# EAGLE design PWB-MXR (EAGLE 6.1)
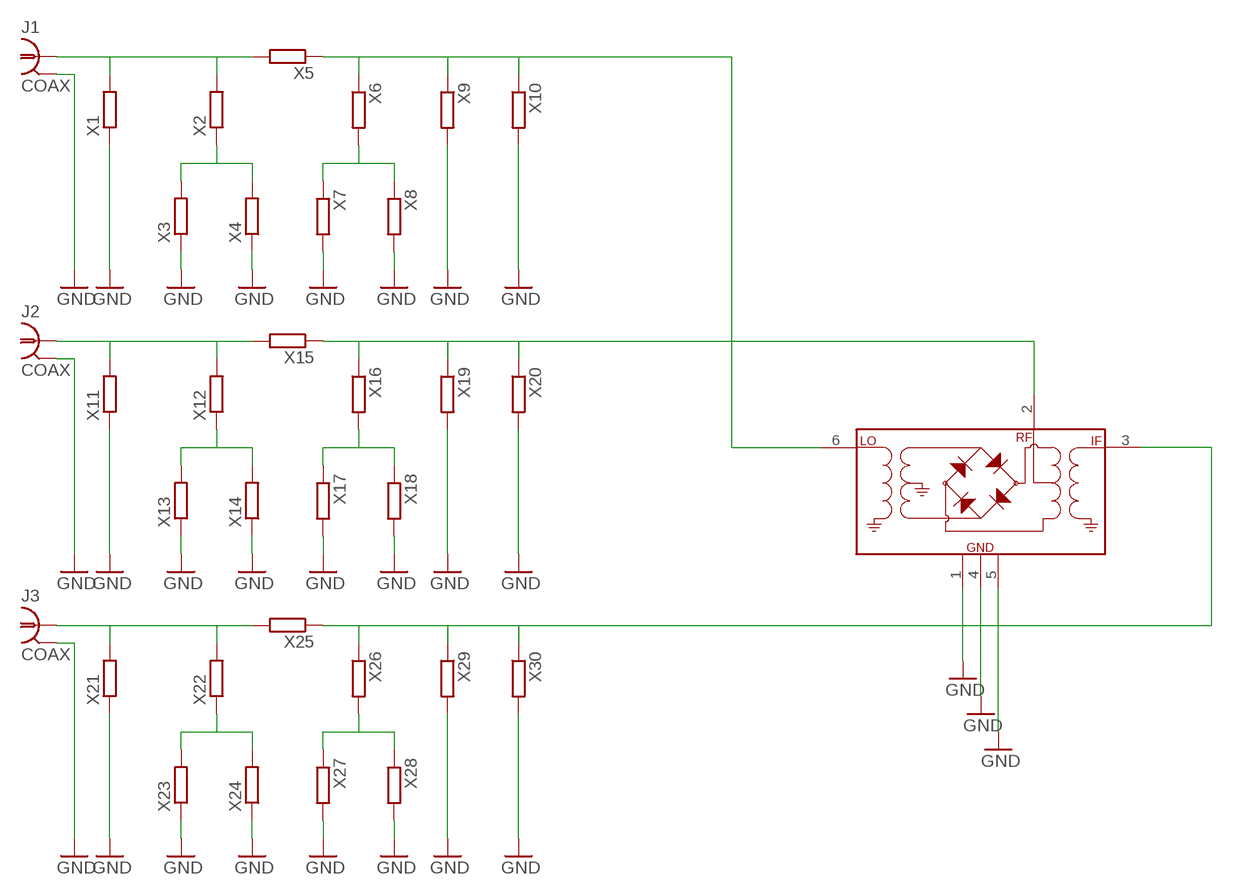
[diagram p0: schematic, sheet 1]

## Parts
J1  COAX  [SLIM_COAX_PAD]
J2  COAX  [SLIM_COAX_PAD]
J3  COAX  [SLIM_COAX_PAD]
U$1  ADE-11X  [CD542]
X1  R-EU_M0805  [M0805]
X2  R-EU_M0805  [M0805]
X3  R-EU_M0805  [M0805]
X4  R-EU_M0805  [M0805]
X5  R-EU_M0805  [M0805]
X6  R-EU_M0805  [M0805]
X7  R-EU_M0805  [M0805]
X8  R-EU_M0805  [M0805]
X9  R-EU_M0805  [M0805]
X10  R-EU_M0805  [M0805]
X11  R-EU_M0805  [M0805]
X12  R-EU_M0805  [M0805]
X13  R-EU_M0805  [M0805]
X14  R-EU_M0805  [M0805]
X15  R-EU_M0805  [M0805]
X16  R-EU_M0805  [M0805]
X17  R-EU_M0805  [M0805]
X18  R-EU_M0805  [M0805]
X19  R-EU_M0805  [M0805]
X20  R-EU_M0805  [M0805]
X21  R-EU_M0805  [M0805]
X22  R-EU_M0805  [M0805]
X23  R-EU_M0805  [M0805]
X24  R-EU_M0805  [M0805]
X25  R-EU_M0805  [M0805]
X26  R-EU_M0805  [M0805]
X27  R-EU_M0805  [M0805]
X28  R-EU_M0805  [M0805]
X29  R-EU_M0805  [M0805]
X30  R-EU_M0805  [M0805]

## Nets
GND: J1.P$2(GND) J2.P$2(GND) J3.P$2(GND) U$1.1(GND) U$1.4(GND) U$1.5(GND) X1.1 X3.1 X4.1 X7.2 X8.2 X9.2 X10.2 X11.1 X13.1 X14.1 X17.2 X18.2 X19.2 X20.2 X21.1 X23.1 X24.1 X27.2 X28.2 X29.2 X30.2
N$1: J1.P$1 X1.2 X2.2 X5.2
N$2: U$1.6(LO) X5.1 X6.1 X9.1 X10.1
N$3: X2.1 X3.2 X4.2
N$4: X6.2 X7.1 X8.1
N$5: J2.P$1 X11.2 X12.2 X15.2
N$6: U$1.2(RF) X15.1 X16.1 X19.1 X20.1
N$7: X12.1 X13.2 X14.2
N$8: X16.2 X17.1 X18.1
N$9: J3.P$1 X21.2 X22.2 X25.2
N$10: U$1.3(IF) X25.1 X26.1 X29.1 X30.1
N$11: X22.1 X23.2 X24.2
N$12: X26.2 X27.1 X28.1

## Library data of the parts
J1-J3 = SLIM:COAX
U$1 = Minicircuits:ADE-11X
X1-X30 = rcl:R-EU_: RESISTOR, European symbol

## Board
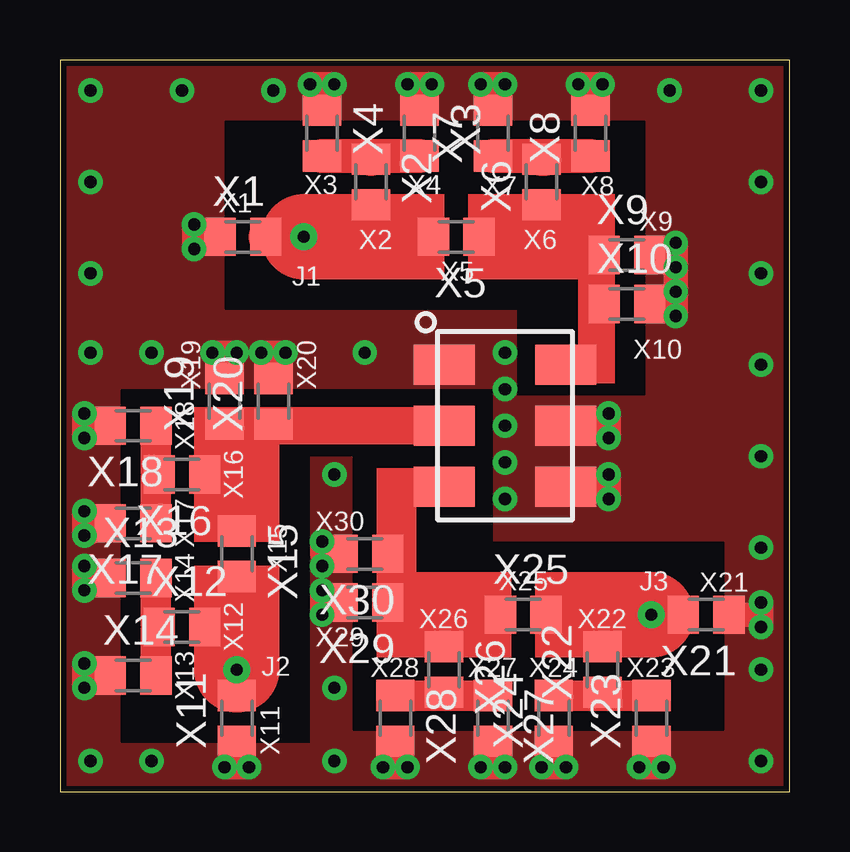
[diagram p1: board, top side]
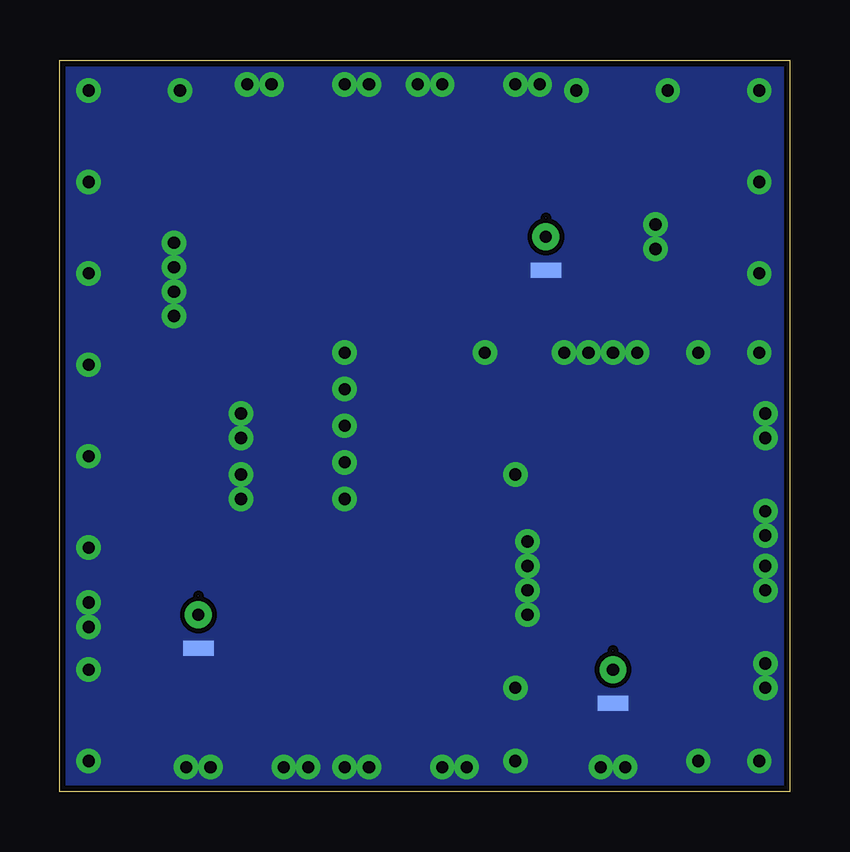
[diagram p2: board, bottom side, seen from below]

Size 30.4 x 30.47 mm. Coordinates in mm from the lower left corner, seen from the top.
Outline: 0,0 30.4,0 30.4,30.47 0,30.47 0,0
Copper layers (1*16): Top 0.035mm / dielectric 1.5mm / Bottom 0.035mm
Design rules: minimum track width 8mil, minimum drill 20mil, track to track 8mil, track to pad 8mil, pad to pad 8mil, via to via 8mil, smd to smd 8mil, copper to edge 10mil, drill to drill 8mil, minimum pad ring 12mil, minimum via ring 10mil, stop-mask expansion 4mil, vias tented up to drill 25mil, thermal gap 10mil
tRestrict: area 19,16.5 to 24.4,20.1; area 7.9,14 to 18,16.8; area 2.5,2 to 10.4,16.8; area 12.2,10.4 to 18,14; area 12.2,2.5 to 27.7,10.4; area 6.9,20.1 to 24.4,27.9

### Footprints (pad centres in the part's own frame; a part is rotated, then mirrored left to right if it is on the bottom)
SLIM_COAX_PAD = drill 0.508 pad 1.016: P$1 0,0 | smd 1.27 x 0.635 bottom: P$2 0,-1.397
CD542 = smd 1.651 x 2.54: 1 -2.54,-2.54; 2 0,-2.54; 3 2.54,-2.54; 4 2.54,2.54; 5 0,2.54; 6 -2.54,2.54
M0805 = smd 1.3 x 1.6: 1 -0.95,0; 2 0.95,0

### Placement (x,y rotation side)
J1  10.16,23.11 0 top
J2  7.37,5.08 0 top
J3  24.64,7.37 0 top
U$1  18.54,15.24 270 top
X1  7.62,23.11 0 top
X2  12.95,25.4 270 top
X3  14.99,27.43 270 top
X4  10.92,27.43 270 top
X5  16.51,23.11 180 top
X6  20.07,25.4 90 top
X7  18.03,27.43 90 top
X8  22.1,27.43 90 top
X9  23.62,22.35 0 top
X10  23.62,20.32 0 top
X11  7.37,3.05 90 top
X12  5.08,6.86 0 top
X13  3.05,8.89 0 top
X14  3.05,4.83 0 top
X15  7.37,9.91 270 top
X16  5.08,13.21 180 top
X17  3.05,11.18 180 top
X18  3.05,15.24 180 top
X19  6.86,16.26 90 top
X20  8.89,16.26 90 top
X21  26.92,7.37 180 top
X22  22.61,5.08 90 top
X23  24.64,3.05 90 top
X24  20.57,3.05 90 top
X25  19.3,7.37 0 top
X26  16,5.08 270 top
X27  18.03,3.05 270 top
X28  13.97,3.05 270 top
X29  12.7,7.87 180 top
X30  12.7,9.91 180 top

### Tracks (layer width: path | path; a pad name or v marks a point on that pad's centre or on a via)
GND  (via drill 0.51)
  Top 1.016: 25.65,20.32 v25.65,19.81 | 25.65,20.32 25.65,22.35 | 25.65,22.35 v25.65,22.86 | 25.65,22.35 X9.2 | X10.2 25.65,20.32 | 6.86,18.29 v6.35,18.29 | 6.86,18.29 v7.37,18.29 | X19.2 6.86,18.29 | 8.89,18.29 v8.38,18.29 | 8.89,18.29 v9.4,18.29 | X20.2 8.89,18.29 | 22.86,15.24 v22.86,14.73 | 22.86,15.24 v22.86,15.75 | 22.86,12.7 v22.86,12.19 | 22.86,12.7 v22.86,13.21 | U$1.4 22.86,12.7 | U$1.5 22.86,15.24 | 10.92,29.46 v11.43,29.46 | 10.92,29.46 v10.41,29.46 | X4.1 10.92,29.46 | 14.99,29.46 v15.49,29.46 | 14.99,29.46 v14.48,29.46 | X3.1 14.99,29.46 | 18.03,29.46 v18.54,29.46 | v17.53,29.46 18.03,29.46 | 18.03,29.46 X7.2 | 22.1,29.46 v22.61,29.46 | 22.1,29.46 v21.59,29.46 | X8.2 22.1,29.46 | 1.02,15.24 v1.02,15.75 | v1.02,14.73 1.02,15.24 | 1.02,15.24 X18.2 | v1.02,11.68 v1.02,10.67 X17.2 | 1.02,8.89 v1.02,8.38 | 1.02,8.89 v1.02,9.4 | X13.1 1.02,8.89 | 1.02,4.83 v1.02,5.33 | 1.02,4.83 v1.02,4.32 | X14.1 1.02,4.83 | 7.37,1.02 v6.86,1.02 | 7.37,1.02 v7.87,1.02 | X11.1 7.37,1.02 | v10.92,7.37 10.92,7.87 | X30.2 10.92,9.91 v10.92,10.41 | 10.92,7.87 X29.2 | 10.92,7.87 v10.92,8.38 | 29.21,7.37 v29.21,6.86 | 29.21,7.37 v29.21,7.87 | X21.1 29.21,7.37 | 24.64,1.02 v25.15,1.02 | 24.64,1.02 v24.13,1.02 | 20.57,1.02 v21.08,1.02 | v20.07,1.02 20.57,1.02 | 18.03,1.02 v18.54,1.02 | v17.53,1.02 18.03,1.02 | 18.03,1.02 X27.2 | 20.57,1.02 X24.1 | X23.1 24.64,1.02 | 13.97,1.02 v13.46,1.02 | 13.97,1.02 v14.48,1.02 | X28.2 13.97,1.02 | v5.59,22.61 5.59,23.11 | 5.59,23.11 v5.59,23.62 | 5.59,23.11 X1.1
  other vias: 10.92,9.4 11.43,13.21 25.65,21.84 25.65,20.83 18.54,18.29 18.54,16.76 18.54,15.24 18.54,13.72 18.54,12.19 11.43,4.32 11.43,1.27 3.81,1.27 1.27,1.27 1.27,18.29 3.81,18.29 12.7,18.29 1.27,21.59 1.27,25.4 1.27,29.21 5.08,29.21 8.89,29.21 29.21,29.21 25.4,29.21 29.21,25.4 29.21,21.59 29.21,17.78 29.21,13.97 29.21,10.16 29.21,1.27 29.21,5.08
  pour Bottom: 0,30.48 30.48,30.48 30.48,0 0,0
  pour Top (no thermals): 0,30.48 30.48,30.48 30.48,0 0,0
N$1
  Top 1.27: J1.P$1 13.21,23.11 | 13.21,23.11 X5.2 | X2.2 13.21,24.45 13.21,23.11
  Top 1.422: X1.2 J1.P$1
N$2
  Top 1.27: 19.81,22.35 18.22,22.35 X5.1 | 19.81,22.35 X9.1 22.35,22.03 22.35,20.57 | X6.1 20.07,22.61 19.81,22.35 | U$1.6 21.84,17.78 22.35,18.29 22.35,20.57 | X10.1 22.61,20.32 22.35,20.57
N$3
  Top 1.422: X4.2 12.7,26.48 | 12.7,26.48 X3.2 | 12.7,26.48 X2.1
N$4
  Top 1.422: X7.1 20.07,26.48 | 20.07,26.48 X8.1 | X6.2 20.19,26.35 20.07,26.48
N$5
  Top 1.27: 7.37,6.86 J2.P$1 X11.2 | 7.37,6.86 X15.2 | 7.37,6.86 X12.2
N$6
  Top 1.27: 7.37,15.24 8.89,15.24 | 8.89,15.24 U$1.2 | X15.1 7.37,13.21 | 7.37,13.21 7.37,15.24 | 7.37,13.21 X16.1 | X19.1 7.37,15.31 7.37,15.24 | 8.89,15.24 X20.1
N$7
  Top 1.27: X13.2 4,6.99 X12.1 4,6.73 X14.2
N$8
  Top 1.27: X18.1 4,13.34 X16.2 4,13.08 X17.1
N$9
  Top 1.27: X21.2 J3.P$1 22.86,7.37 | X25.2 22.86,7.37 | X22.2 22.61,7.11 22.86,7.37
N$10
  Top 1.27: 14.22,7.87 X29.1 | 14.22,12.7 U$1.3 | 14.22,12.7 13.97,12.7 | 14.22,9.91 14.22,7.87 | 14.22,9.91 14.22,12.7 | X30.1 14.22,9.91 | 14.22,7.87 16,7.87 | 16,7.87 17.85,7.87 X25.1 | 16,7.87 X26.1
N$11
  Top 1.27: X24.2 22.61,4 | 22.61,4 X23.2 | 22.61,4 X22.1
N$12
  Top 1.27: X28.1 16,4 | 16,4 X27.1 | 16,4 X26.2
(copper drawn outside any net)
  shapes: Top area x9, Top circle x3

### Text on the board
_tsilk: X7 | X8 | X3 | X4 | X1 | X2 | X6 | X9 | X5 | J1 | X10 | X19 | X20 | X18 | X16 | X30 | X15 | X17 | X21 | X14 | X26 | X25 | X22 | J3 | X29 | X12 | X28 | X27 | X24 | X23 | J2 | X13 | X11
_bsilk: J1 | J3 | J2